# Altium schematic sheet Ethernet.SchDoc
size 420 x 297 mm; SheetNumber: 6; SheetTotal: 11
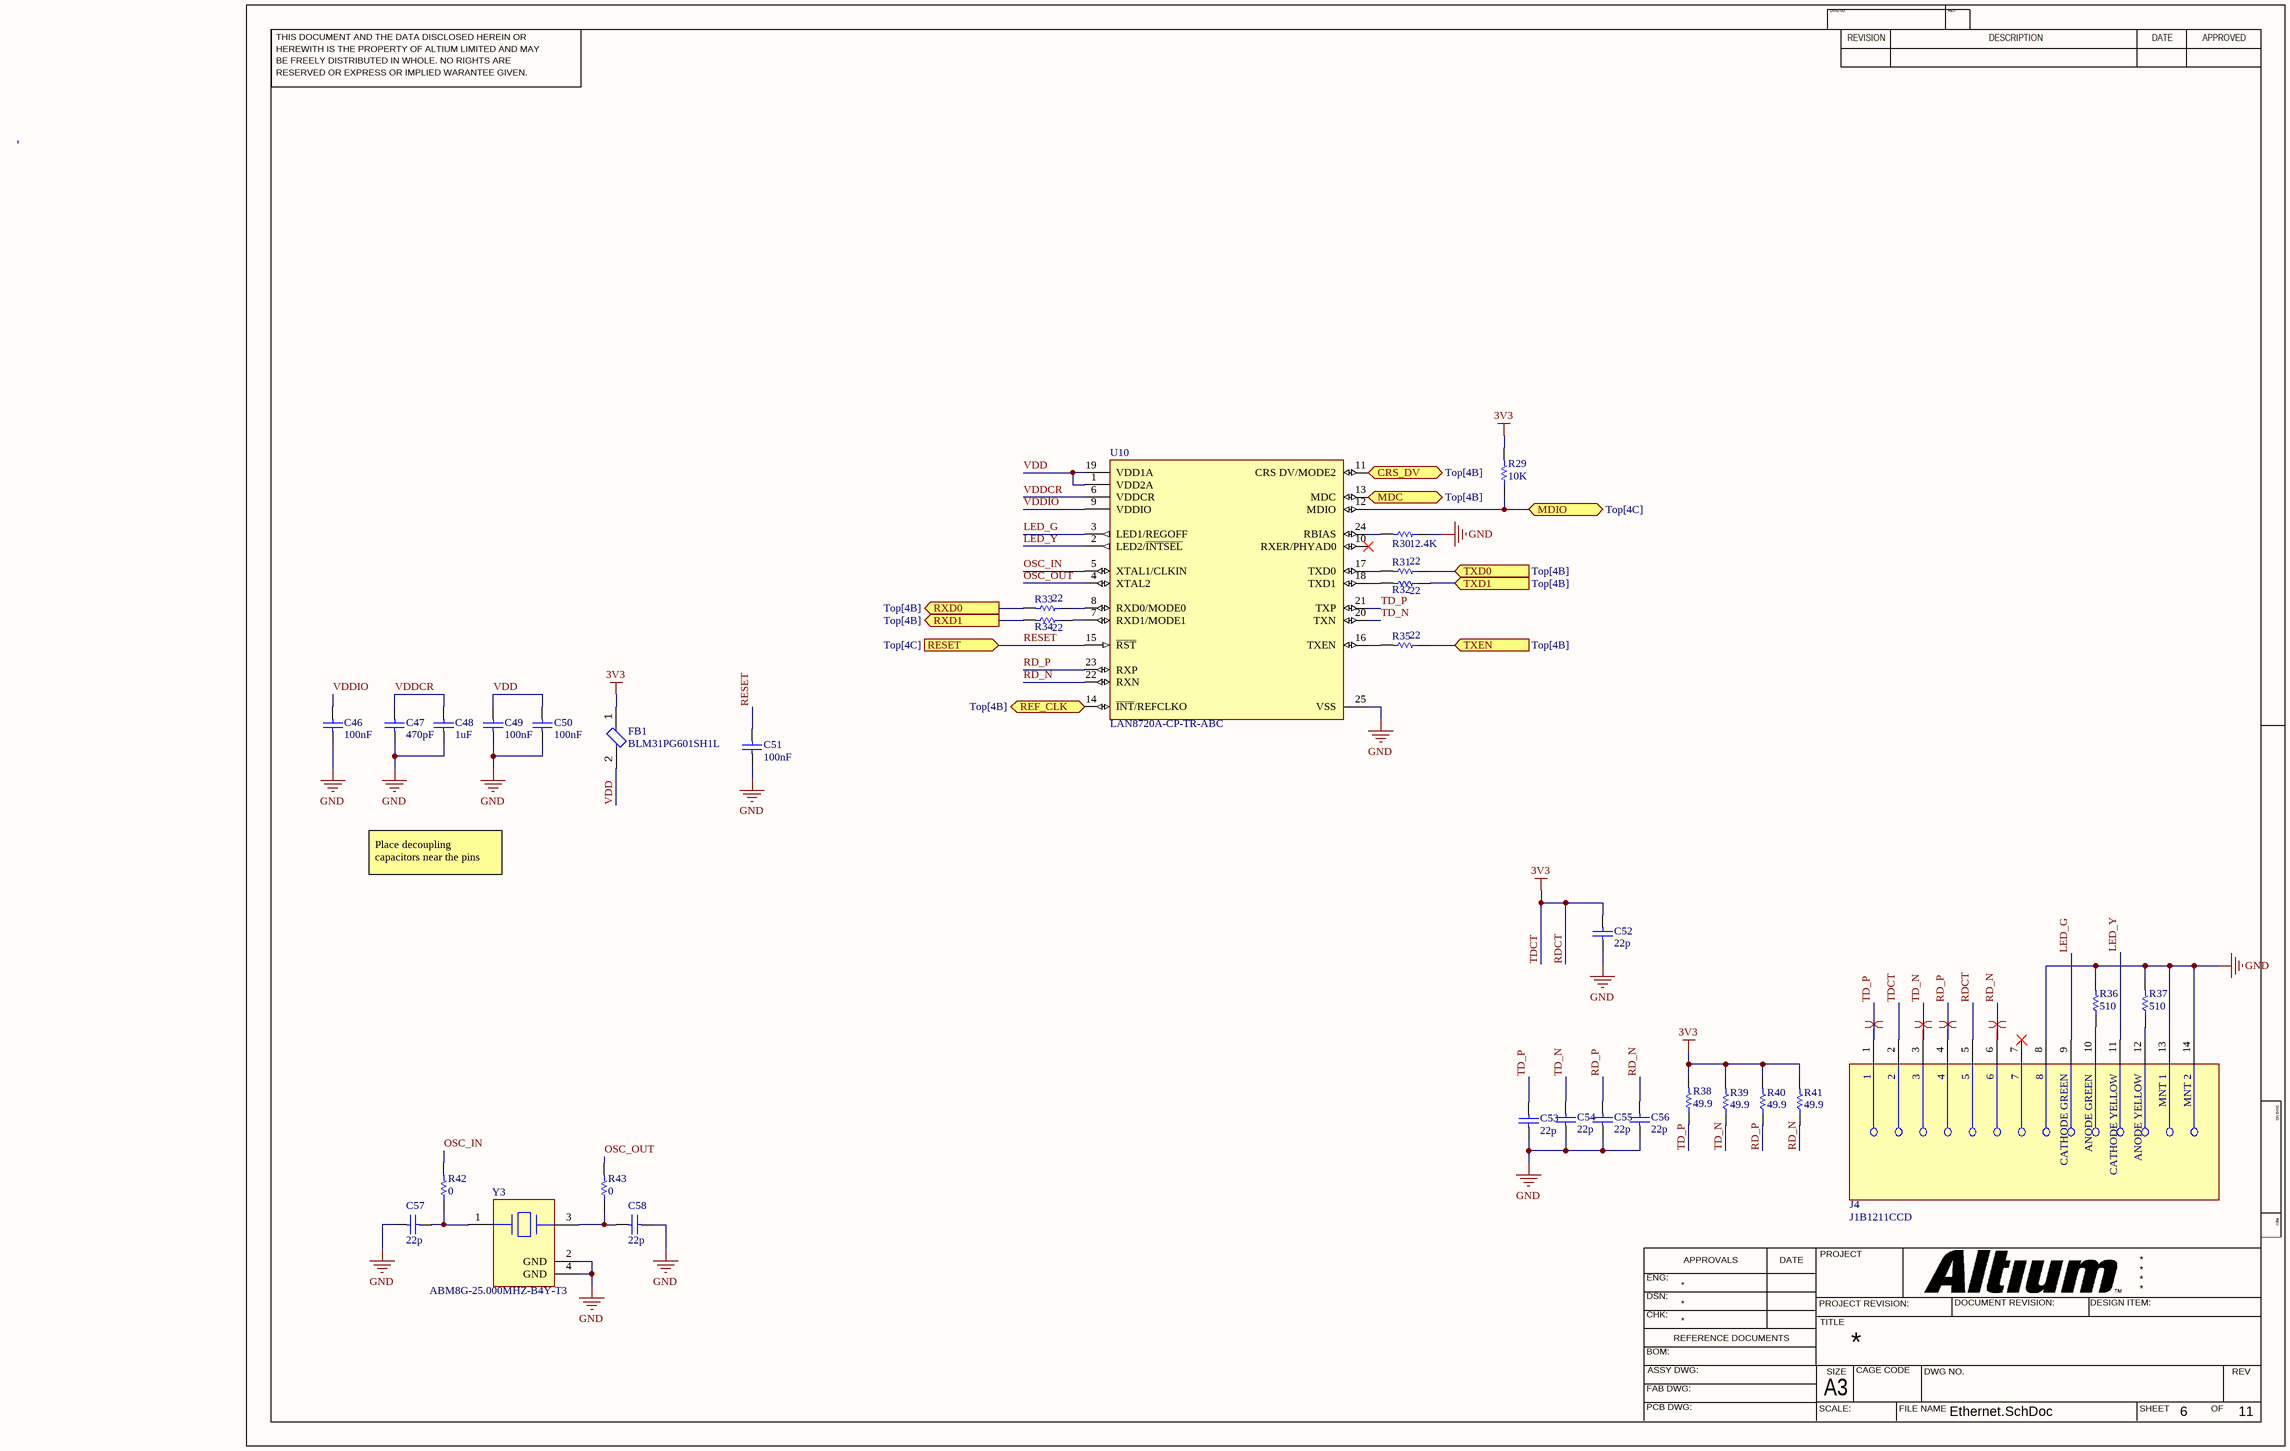
[diagram p0: Ethernet.SchDoc]

## Parts
C46  value 100nF  (hidden comment: Capacitor)
C47  value 470pF  (hidden comment: Capacitor)
C48  value 1uF  (hidden comment: Capacitor)
C49  value 100nF  (hidden comment: Capacitor)
C50  value 100nF  (hidden comment: Capacitor)
C51  value 100nF  (hidden comment: Capacitor)
C52  value 22p  (hidden comment: Capacitor)
C53  value 22p  (hidden comment: Capacitor)
C54  value 22p  (hidden comment: Capacitor)
C55  value 22p  (hidden comment: Capacitor)
C56  value 22p  (hidden comment: Capacitor)
C57  value 22p  (hidden comment: Capacitor)
C58  value 22p  (hidden comment: Capacitor)
FB1  BLM31PG601SH1L  [FP-BLM31-0_2-t1_1-MFG]
J4  J1B1211CCD  [FP-J1B1211CCD-MFG]
R29  value 10K  (hidden comment: Resistor)
R30  value 12.4K  (hidden comment: Resistor)
R31  value 22  (hidden comment: Resistor)
R32  value 22  (hidden comment: Resistor)
R33  value 22  (hidden comment: Resistor)
R34  value 22  (hidden comment: Resistor)
R35  value 22  (hidden comment: Resistor)
R36  value 510  (hidden comment: Resistor)
R37  value 510  (hidden comment: Resistor)
R38  value 49.9  (hidden comment: Resistor)
R39  value 49.9  (hidden comment: Resistor)
R40  value 49.9  (hidden comment: Resistor)
R41  value 49.9  (hidden comment: Resistor)
R42  value 0  (hidden comment: Resistor)
R43  value 0  (hidden comment: Resistor)
U10  LAN8720A-CP-TR-ABC  [FP-24-S4QFN-4x4B-0_5P-IPC_B]
Y3  ABM8G-25.000MHZ-B4Y-T3  [FP-ABM8G-MFG]

## Ports
CRS_DV (bidir, see Top[4B]), MDC (bidir, see Top[4B]), MDIO (bidir, see Top[4C]), REF_CLK (bidir, see Top[4B]), RESET (in, see Top[4C]), RXD0 (out, see Top[4B]), RXD1 (out, see Top[4B]), TXD0 (in, see Top[4B]), TXD1 (in, see Top[4B]), TXEN (in, see Top[4B])

## Nets
GND: C46.1 C47.1 C48.1 C49.1 C50.1 C51.1 C52.1 C53.1 C54.1 C55.1 C56.1 C57.2 C58.1 J4.8 J4.13(MNT_1) J4.14(MNT_2) R30.1 R36.2 R37.2 U10.25(VSS) Y3.2(GND) Y3.4(GND)
RDCT: C52.2 FB1.1 J4.2 J4.5 R29.2 R38.2 R39.2 R40.2 R41.2  [also labelled 3V3, TDCT]
CRS_DV: U10.11(CRS_DV/MODE2) ; port CRS_DV
LED_G: J4.9(CATHODE_GREEN) U10.3(LED1/REGOFF)
LED_Y: J4.11(CATHODE_YELLOW) U10.2(LED2/~{INTSEL})
MDC: U10.13(MDC) ; port MDC
MDIO: R29.1 U10.12(MDIO) ; port MDIO
OSC_IN: R42.2 U10.5(XTAL1/CLKIN)
OSC_OUT: R43.2 U10.4(XTAL2)
RD_N: C56.2 J4.6 R41.1 U10.22(RXN)
RD_P: C55.2 J4.4 R40.1 U10.23(RXP)
REF_CLK: U10.14(~{INT}/REFCLKO) ; port REF_CLK
RESET: C51.2 U10.15(~{RST}) ; port RESET
RXD0: R33.2 ; port RXD0
RXD1: R34.2 ; port RXD1
TD_N: C54.2 J4.3 R39.1 U10.20(TXN)
TD_P: C53.2 J4.1 R38.1 U10.21(TXP)
TXD0: R31.1 ; port TXD0
TXD1: R32.1 ; port TXD1
TXEN: R35.1 ; port TXEN
VDD: C49.2 C50.2 FB1.2 U10.1(VDD2A) U10.19(VDD1A)
VDDCR: C47.2 C48.2 U10.6(VDDCR)
VDDIO: C46.2 U10.9(VDDIO)
NetC57_1: C57.1 R42.1 Y3.1
NetC58_2: C58.2 R43.1 Y3.3
NetJ4_10: J4.10(ANODE_GREEN) R36.1
NetJ4_12: J4.12(ANODE_YELLOW) R37.1
NetR30_2: R30.2 U10.24(RBIAS)
NetR31_2: R31.2 U10.17(TXD0)
NetR32_2: R32.2 U10.18(TXD1)
NetR33_1: R33.1 U10.8(RXD0/MODE0)
NetR34_1: R34.1 U10.7(RXD1/MODE1)
NetR35_2: R35.2 U10.16(TXEN)

Not connected (* = marked no-connect by the designer): J4 7*; U10 10(RXER/PHYAD0)*

## Layout directives
differential pair: RD_N, RD_P, TD_N, TD_P

## Notes on the sheet
- Place decoupling capacitors near the pins
- THIS DOCUMENT AND THE DATA DISCLOSED HEREIN OR
- HEREWITH IS THE PROPERTY OF ALTIUM LIMITED AND MAY
- DWG NO:
- REVISION
- REV:
- DESCRIPTION
- DATE
- APPROVED
- BE FREELY DISTRIBUTED IN WHOLE. NO RIGHTS ARE
- RESERVED OR EXPRESS OR IMPLIED WARANTEE GIVEN.
- ENG:
- APPROVALS
- PROJECT
- DSN:
- CHK:
- REFERENCE DOCUMENTS
- PROJECT REVISION:
- TITLE
- DOCUMENT REVISION:
- DESIGN ITEM:
- BOM:
- FAB DWG:
- PCB DWG:
- ASSY DWG:
- SCALE:
- A3
- SIZE
- CAGE CODE
- FILE NAME
- DWG NO.
- SHEET
- OF
- REV

## Library data of the parts
C46-C58 = Capacitor: SimulationGenericComponent: True
  C46-C51: Supplier 1: Arrow Electronics
FB1 = CMP-06046-002041-1: Chip Ferrite Bead Array, 1206, 600Ω @ 100MHz, 0.08Ω, 25%, 1.5A; Impedance: 600R; DC Resistance (DCR): 90mR; Number of Lines: 1; Shielding: Unshielded; Package Quantity: 3000; Series: EMIFIL®, BLM31P; Core Material: Ferrite; Case Code (Metric): 3216; RoHS Compliant: Yes; Length: 3.2mm; Max Current Rating: 1.5A; Test Frequency: 100MHz; Max Operating Temperature: 125°C; Tolerance: 25%; Termination: SMD/SMT; Height: 1.1mm; Case Code (Imperial): 1206; Lead Free: Lead Free; Width: 0.063inch; Case/Package: 1206; Ratings: AEC-Q200; Mount: Surface Mount; Current Rating: 1.5A; Min Operating Temperature: -55°C; Depth: 1.8mm; Packaging: Tape and Reel; Max DC Current: 1.5A; Material: Ferrite; Resistance: 600R
J4 = CMP-240752-000001-1: CONN JACK 1PORT 100 BASE-T PCB; Number of Cores per Jack: 4; Direction: Down; Connector Type: RJ45; Shielding: Shielded; Number of Ports: 1; Termination: Solder; Packaging: Bulk; Contact Material: Brass; Color: Green; Number of Rows: 1; Mount: Through Hole; Series: -; Contact Plating: Gold; Max Operating Temperature: 85°C; Min Operating Temperature: -40°C; Housing Material: Thermoplastic
R29-R41 = Resistor: TC1: 0; SimulationGenericComponent: True; TC2: 0
R42 R43 = Resistor: SimulationGenericComponent: True; TC1: 0; TC2: 0; Supplier 1: Digi-Key; Supplier Part Number 1: P0.0GCT-ND
U10 = CMP-06281-000039-1: IC TRANSCEIVER FULL 2/2 24SQFN; Simplex/Duplex: Full Duplex; Max Operating Temperature: 85°C; Packaging: Tape and Reel; Min Operating Temperature: 0°C; Mount: Surface Mount
Y3 = CMP-27762-015306-1: Crystal 25MHz ±30ppm (Tol) ±30ppm (Stability) 10pF FUND 60Ω 4-Pin SMD T/R; ESR (Equivalent Series Resistance): 60R; Max Operating Temperature: 70°C; Packaging: Tape and Reel; Length: 0.126inch; Height: 0.039inch; Frequency Stability: 30ppm; Package Quantity: 3000; Width: 2.5mm; Number of Pins: 4; Case/Package: SMD/SMT; Mount: Surface Mount; Series: ABM8G; Load Capacitance: 10pF; Min Operating Temperature: -20°C; Termination: SMD/SMT; Frequency: 25MHz; Tolerance: 30ppm; Frequency Tolerance: 30ppm